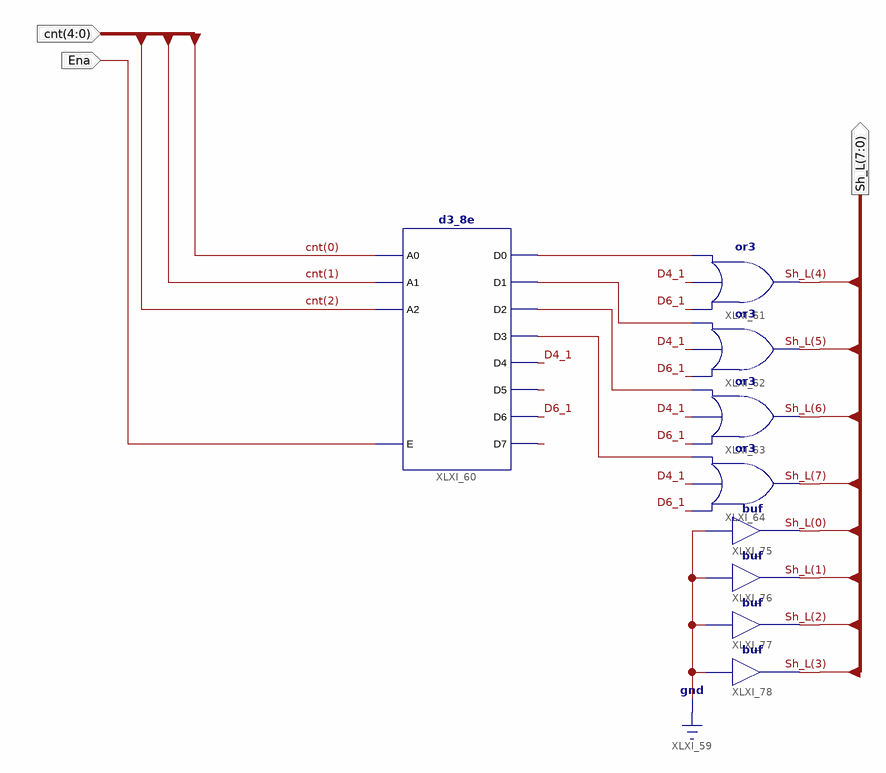
[diagram p0: schematic sheet 1]
// Xilinx ISE schematic Sh_LM.sch (spartan6) as structural Verilog: 9 symbols, 3 ports
module Sh_LM (
  input  [4:0] cnt,
  input  Ena,
  output [7:0] Sh_L
);

  wire D4_1, D6_1, XLXN_103, XLXN_104, XLXN_105, XLXN_106, XLXN_108, XLXN_110;

  d3_8e XLXI_60 (
    .A0(cnt[0]), .A1(cnt[1]), .A2(cnt[2]), .E(Ena), .D0(XLXN_103), .D1(XLXN_105), .D2(XLXN_104),
    .D3(XLXN_106), .D4(D4_1), .D5(XLXN_108), .D6(D6_1), .D7(XLXN_110));
  or XLXI_61 (Sh_L[4], D6_1, D4_1, XLXN_103);
  or XLXI_62 (Sh_L[5], D6_1, D4_1, XLXN_105);
  or XLXI_63 (Sh_L[6], D6_1, D4_1, XLXN_104);
  or XLXI_64 (Sh_L[7], D6_1, D4_1, XLXN_106);
  buf XLXI_75 (Sh_L[0], 1'b0);
  buf XLXI_76 (Sh_L[1], 1'b0);
  buf XLXI_77 (Sh_L[2], 1'b0);
  buf XLXI_78 (Sh_L[3], 1'b0);
endmodule
